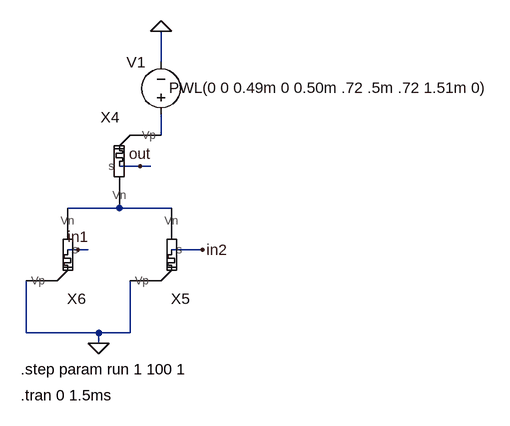
[diagram p0: schematic FELIX_variation.asc]
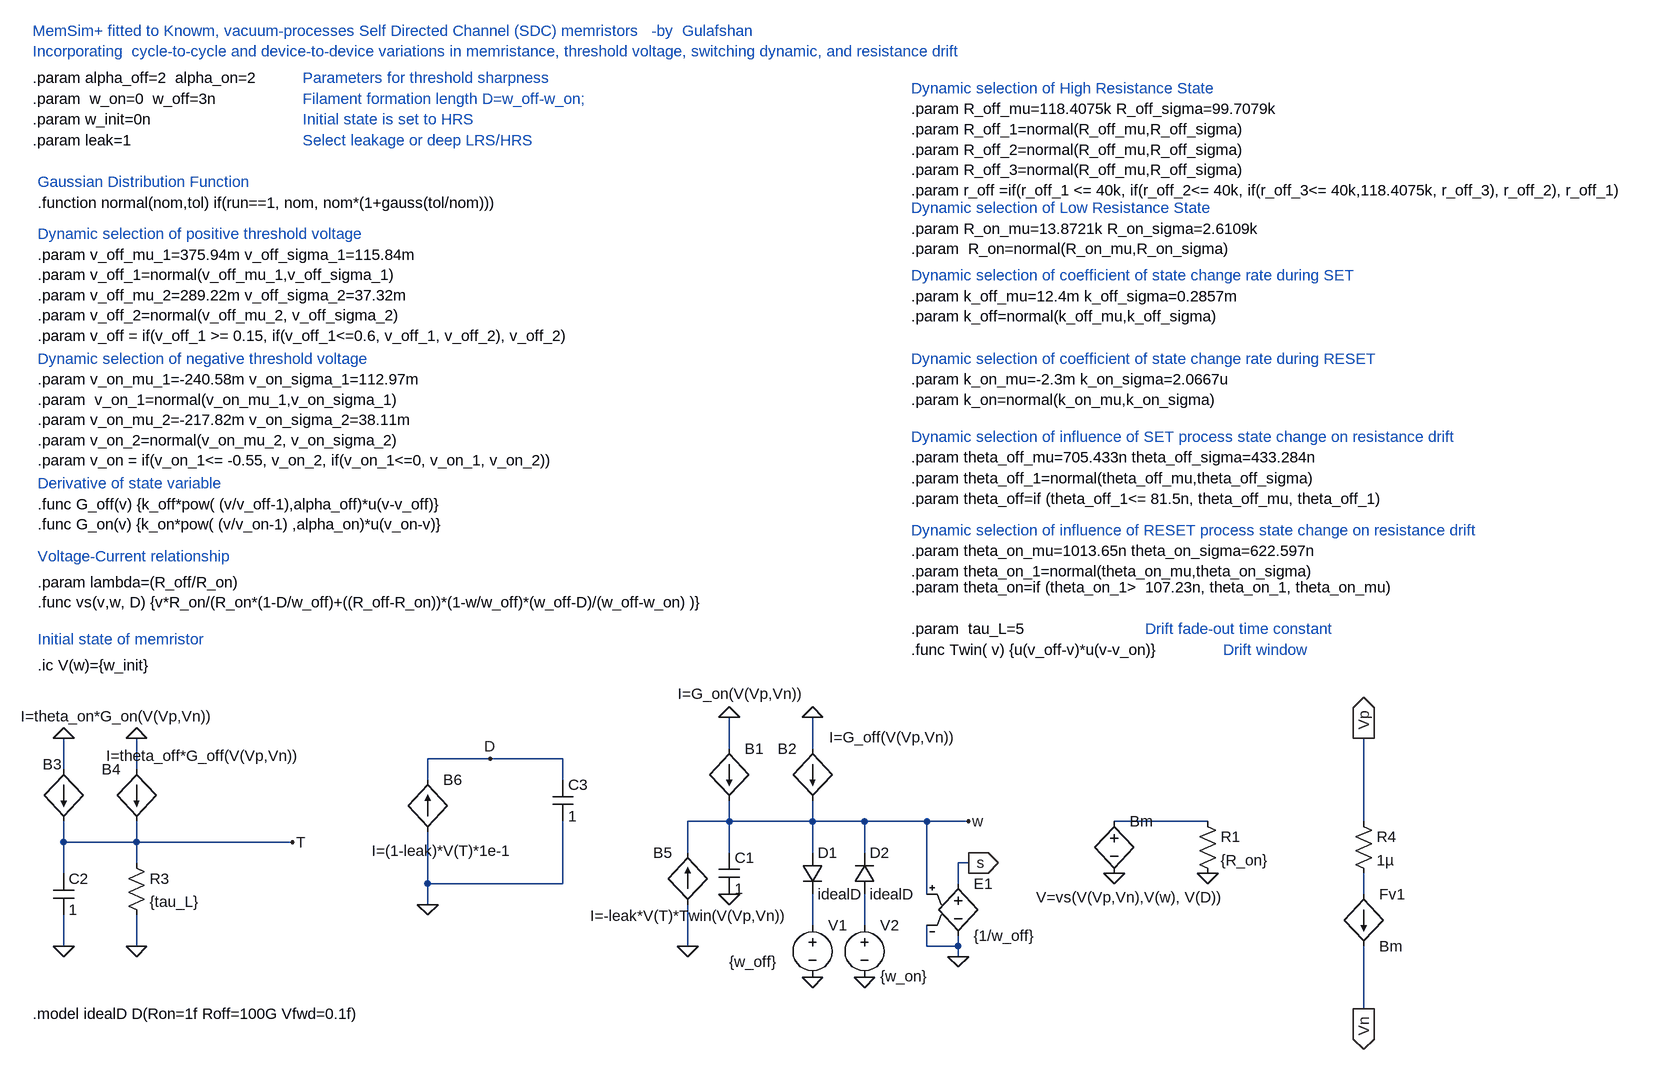
[diagram p1: sub-circuit memsim+sdc_variation.asc]
FELIX_variation.asc, the LTspice schematic file:
Version 4
SHEET 1 880 680
WIRE 256 -48 256 -96
WIRE 256 64 256 32
WIRE 224 112 192 112
WIRE 240 112 224 112
WIRE 192 176 112 176
WIRE 272 176 192 176
WIRE 128 240 112 240
WIRE 144 240 128 240
WIRE 320 240 272 240
WIRE 48 368 48 288
WIRE 160 368 48 368
WIRE 208 368 208 288
WIRE 208 368 160 368
WIRE 160 384 160 368
FLAG 160 384 0
FLAG 256 -96 0
FLAG 128 240 in1
FLAG 224 112 out
FLAG 320 240 in2
SYMBOL voltage 256 48 R180
WINDOW 0 24 96 Left 2
WINDOW 3 -506 57 Left 2
WINDOW 123 0 0 Left 0
WINDOW 39 0 0 Left 0
SYMATTR InstName V1
SYMATTR Value PWL(0 0 0.49m 0 0.50m .72 .5m .72 1.51m 0)
SYMBOL MemSim+SDC_variation 144 64 R0
SYMATTR InstName X4
SYMBOL MemSim+SDC_variation 320 288 R180
SYMATTR InstName X5
SYMBOL MemSim+SDC_variation 160 288 R180
SYMATTR InstName X6
TEXT 40 464 Left 2 !.tran 0 1.5ms
TEXT 40 424 Left 2 !.step param run 1 100 1

memsim+sdc_variation.asc, the sub-circuit schematic file:
Version 4
SHEET 1 2968 1664
WIRE 1120 800 1120 752
WIRE 1248 800 1248 752
WIRE 752 816 656 816
WIRE 864 816 752 816
WIRE 96 832 96 784
WIRE 208 832 208 784
WIRE 656 848 656 816
WIRE 864 848 864 816
WIRE 1120 912 1120 880
WIRE 1120 912 1056 912
WIRE 1248 912 1248 880
WIRE 1248 912 1120 912
WIRE 1328 912 1248 912
WIRE 1424 912 1328 912
WIRE 1488 912 1424 912
WIRE 1856 912 1712 912
WIRE 2096 912 2096 784
WIRE 96 944 96 912
WIRE 208 944 208 912
WIRE 208 944 96 944
WIRE 448 944 208 944
WIRE 1056 960 1056 912
WIRE 1120 960 1120 912
WIRE 1248 960 1248 912
WIRE 1328 960 1328 912
WIRE 208 976 208 944
WIRE 1488 976 1472 976
WIRE 96 992 96 944
WIRE 656 1008 656 928
WIRE 864 1008 864 912
WIRE 864 1008 656 1008
WIRE 1472 1008 1472 976
WIRE 1424 1024 1424 912
WIRE 2096 1024 2096 992
WIRE 656 1040 656 1008
WIRE 1248 1072 1248 1024
WIRE 1328 1072 1328 1024
WIRE 96 1104 96 1056
WIRE 208 1104 208 1056
WIRE 1056 1104 1056 1040
WIRE 1424 1104 1424 1072
WIRE 1472 1104 1472 1088
WIRE 1472 1104 1424 1104
WIRE 1472 1120 1472 1104
WIRE 2096 1200 2096 1104
FLAG 1120 752 0
FLAG 1248 752 0
FLAG 1120 1024 0
FLAG 1248 1152 0
FLAG 1328 1152 0
FLAG 1488 912 w
FLAG 1712 992 0
FLAG 1856 992 0
FLAG 1472 1120 0
FLAG 1488 976 s
IOPIN 1488 976 Out
FLAG 96 1104 0
FLAG 448 944 T
FLAG 96 784 0
FLAG 208 784 0
FLAG 208 1104 0
FLAG 1056 1104 0
FLAG 2096 784 Vp
IOPIN 2096 784 Out
FLAG 2096 1200 Vn
IOPIN 2096 1200 Out
FLAG 656 1040 0
FLAG 752 816 D
SYMBOL bi 1120 800 R0
WINDOW 3 -79 -84 Left 2
SYMATTR Value I=G_on(V(Vp,Vn))
SYMATTR InstName B1
SYMBOL bi 1248 800 M0
WINDOW 3 -220 -17 Left 2
SYMATTR Value I=G_off(V(Vp,Vn))
SYMATTR InstName B2
SYMBOL cap 1104 960 R0
SYMATTR InstName C1
SYMATTR Value 1
SYMBOL diode 1232 960 R0
SYMATTR InstName D1
SYMATTR Value idealD
SYMBOL diode 1312 1024 M180
WINDOW 0 24 64 Left 2
WINDOW 3 24 0 Left 2
SYMATTR InstName D2
SYMATTR Value idealD
SYMBOL voltage 1248 1056 R0
WINDOW 123 0 0 Left 2
WINDOW 39 0 0 Left 2
WINDOW 3 -128 72 Left 2
SYMATTR Value {w_off}
SYMATTR InstName V1
SYMBOL voltage 1328 1056 R0
WINDOW 3 24 94 Left 2
WINDOW 123 0 0 Left 2
WINDOW 39 0 0 Left 2
SYMATTR Value {w_on}
SYMATTR InstName V2
SYMBOL res 1840 896 R0
SYMATTR InstName R1
SYMATTR Value {R_on}
SYMBOL bv 1712 896 R0
WINDOW 3 -120 133 Left 2
SYMATTR Value V=vs(V(Vp,Vn),V(w), V(D))
SYMATTR InstName Bm
SYMBOL e 1472 992 R0
SYMATTR InstName E1
SYMATTR Value {1/w_off}
SYMBOL cap 80 992 R0
SYMATTR InstName C2
SYMATTR Value 1
SYMBOL bi 96 832 R0
WINDOW 3 -66 -82 Left 2
WINDOW 0 -32 -8 Left 2
SYMATTR Value I=theta_on*G_on(V(Vp,Vn))
SYMATTR InstName B3
SYMBOL bi 208 832 M0
WINDOW 3 -251 -21 Left 2
SYMATTR Value I=theta_off*G_off(V(Vp,Vn))
SYMATTR InstName B4
SYMBOL res 192 960 R0
SYMATTR InstName R3
SYMATTR Value {tau_L}
SYMBOL bi 1056 1040 R180
WINDOW 3 -154 -17 Left 2
WINDOW 0 24 80 Left 2
SYMATTR Value I=-leak*V(T)*Twin(V(Vp,Vn))
SYMATTR InstName B5
SYMBOL f 2096 1024 R0
SYMATTR InstName Fv1
SYMATTR Value Bm
SYMATTR Value2 -1
SYMBOL res 2080 896 R0
SYMATTR InstName R4
SYMATTR Value 1µ
SYMBOL bi 656 928 M180
WINDOW 3 -86 -29 Left 2
WINDOW 0 24 80 Left 2
SYMATTR Value I=(1-leak)*V(T)*1e-1
SYMATTR InstName B6
SYMBOL cap 848 848 R0
SYMATTR InstName C3
SYMATTR Value 1
TEXT 48 -232 Left 2 !.param alpha_off=2  alpha_on=2
TEXT 48 -200 Left 2 !.param  w_on=0  w_off=3n
TEXT 48 -304 Left 2 ;MemSim+ fitted to Knowm, vacuum-processes Self Directed Channel (SDC) memristors   -by  Gulafshan\nIncorporating  cycle-to-cycle and device-to-device variations in memristance, threshold voltage, switching dynamic, and resistance drift
TEXT 56 672 Left 2 !.ic V(w)={w_init}
TEXT 56 392 Left 2 ;Derivative of state variable
TEXT 56 504 Left 2 ;Voltage-Current relationship
TEXT 56 632 Left 2 ;Initial state of memristor
TEXT 48 1208 Left 2 !.model idealD D(Ron=1f Roff=100G Vfwd=0.1f)
TEXT 48 -168 Left 2 !.param w_init=0n
TEXT 56 -40 Left 2 !.function normal(nom,tol) if(run==1, nom, nom*(1+gauss(tol/nom)))
TEXT 1400 616 Left 2 !.param  tau_L=5
TEXT 1400 648 Left 2 !.func Twin( v) {u(v_off-v)*u(v-v_on)}
TEXT 1400 104 Left 2 !.param k_off_mu=12.4m k_off_sigma=0.2857m\n.param k_off=normal(k_off_mu,k_off_sigma)
TEXT 1400 232 Left 2 !.param k_on_mu=-2.3m k_on_sigma=2.0667u\n.param k_on=normal(k_on_mu,k_on_sigma)
TEXT 1400 352 Left 2 !.param theta_off_mu=705.433n theta_off_sigma=433.284n
TEXT 1400 384 Left 2 !.param theta_off_1=normal(theta_off_mu,theta_off_sigma)
TEXT 1400 416 Left 2 !.param theta_off=if (theta_off_1<= 81.5n, theta_off_mu, theta_off_1)
TEXT 1400 496 Left 2 !.param theta_on_mu=1013.65n theta_on_sigma=622.597n\n.param theta_on_1=normal(theta_on_mu,theta_on_sigma)
TEXT 1400 552 Left 2 !.param theta_on=if (theta_on_1>  107.23n, theta_on_1, theta_on_mu)
TEXT 56 8 Left 2 ;Dynamic selection of positive threshold voltage
TEXT 56 200 Left 2 ;Dynamic selection of negative threshold voltage
TEXT 1400 -216 Left 2 ;Dynamic selection of High Resistance State
TEXT 1400 -32 Left 2 ;Dynamic selection of Low Resistance State
TEXT 56 -72 Left 2 ;Gaussian Distribution Function
TEXT 464 -232 Left 2 ;Parameters for threshold sharpness
TEXT 464 -200 Left 2 ;Filament formation length D=w_off-w_on;
TEXT 464 -168 Left 2 ;Initial state is set to HRS
TEXT 1400 72 Left 2 ;Dynamic selection of coefficient of state change rate during SET
TEXT 1400 200 Left 2 ;Dynamic selection of coefficient of state change rate during RESET
TEXT 1400 320 Left 2 ;Dynamic selection of influence of SET process state change on resistance drift
TEXT 1400 464 Left 2 ;Dynamic selection of influence of RESET process state change on resistance drift
TEXT 1760 616 Left 2 ;Drift fade-out time constant
TEXT 1880 648 Left 2 ;Drift window
TEXT 48 -136 Left 2 !.param leak=1
TEXT 464 -136 Left 2 ;Select leakage or deep LRS/HRS
TEXT 56 40 Left 2 !.param v_off_mu_1=375.94m v_off_sigma_1=115.84m\n.param v_off_1=normal(v_off_mu_1,v_off_sigma_1)\n.param v_off_mu_2=289.22m v_off_sigma_2=37.32m\n.param v_off_2=normal(v_off_mu_2, v_off_sigma_2)\n.param v_off = if(v_off_1 >= 0.15, if(v_off_1<=0.6, v_off_1, v_off_2), v_off_2)
TEXT 56 232 Left 2 !.param v_on_mu_1=-240.58m v_on_sigma_1=112.97m\n.param  v_on_1=normal(v_on_mu_1,v_on_sigma_1)\n.param v_on_mu_2=-217.82m v_on_sigma_2=38.11m\n.param v_on_2=normal(v_on_mu_2, v_on_sigma_2)\n.param v_on = if(v_on_1<= -0.55, v_on_2, if(v_on_1<=0, v_on_1, v_on_2))
TEXT 56 424 Left 2 !.func G_off(v) {k_off*pow( (v/v_off-1),alpha_off)*u(v-v_off)}\n.func G_on(v) {k_on*pow( (v/v_on-1) ,alpha_on)*u(v_on-v)}
TEXT 56 544 Left 2 !.param lambda=(R_off/R_on)\n.func vs(v,w, D) {v*R_on/(R_on*(1-D/w_off)+((R_off-R_on))*(1-w/w_off)*(w_off-D)/(w_off-w_on) )}
TEXT 1400 -184 Left 2 !.param R_off_mu=118.4075k R_off_sigma=99.7079k\n.param R_off_1=normal(R_off_mu,R_off_sigma)\n.param R_off_2=normal(R_off_mu,R_off_sigma)\n.param R_off_3=normal(R_off_mu,R_off_sigma)\n.param r_off =if(r_off_1 <= 40k, if(r_off_2<= 40k, if(r_off_3<= 40k,118.4075k, r_off_3), r_off_2), r_off_1)
TEXT 1400 0 Left 2 !.param R_on_mu=13.8721k R_on_sigma=2.6109k\n.param  R_on=normal(R_on_mu,R_on_sigma)

The netlist it stands for:
* FELIX_variation.asc
V1 N001 0 PWL(0 0 0.49m 0 0.50m .72 .5m .72 1.51m 0)
XX4 out N001 N002 memsim+sdc_variation
XX5 in2 0 N002 memsim+sdc_variation
XX6 in1 0 N002 memsim+sdc_variation

* block symbol definitions
.subckt memsim+sdc_variation s Vp Vn
B1 0 w I=G_on(V(Vp,Vn))
B2 0 w I=G_off(V(Vp,Vn))
C1 w 0 1
D1 w N003 idealD
D2 N004 w idealD
V1 N003 0 {w_off}
V2 N004 0 {w_on}
R1 N001 0 {R_on}
Bm N001 0 V=vs(V(Vp,Vn),V(w), V(D))
E1 s 0 w 0 {1/w_off}
C2 T 0 1
B3 0 T I=theta_on*G_on(V(Vp,Vn))
B4 0 T I=theta_off*G_off(V(Vp,Vn))
R3 T 0 {tau_L}
B5 0 w I=-leak*V(T)*Twin(V(Vp,Vn))
Fv1 N002 Vn Bm -1
R4 Vp N002 1µ
B6 0 D I=(1-leak)*V(T)*1e-1
C3 D 0 1
.param alpha_off=2  alpha_on=2
.param  w_on=0  w_off=3n
* MemSim+ fitted to Knowm, vacuum-processes Self Directed Channel (SDC) memristors   -by  Gulafshan
* Incorporating  cycle-to-cycle and device-to-device variations in memristance, threshold voltage, switching dynamic, and resistance drift
.ic V(w)={w_init}
* Derivative of state variable
* Voltage-Current relationship
* Initial state of memristor
.model idealD D(Ron=1f Roff=100G Vfwd=0.1f)
.param w_init=0n
.function normal(nom,tol) if(run==1, nom, nom*(1+gauss(tol/nom)))
.param  tau_L=5
.func Twin( v) {u(v_off-v)*u(v-v_on)}
.param k_off_mu=12.4m k_off_sigma=0.2857m
.param k_off=normal(k_off_mu,k_off_sigma)
.param k_on_mu=-2.3m k_on_sigma=2.0667u
.param k_on=normal(k_on_mu,k_on_sigma)
.param theta_off_mu=705.433n theta_off_sigma=433.284n
.param theta_off_1=normal(theta_off_mu,theta_off_sigma)
.param theta_off=if (theta_off_1<= 81.5n, theta_off_mu, theta_off_1)
.param theta_on_mu=1013.65n theta_on_sigma=622.597n
.param theta_on_1=normal(theta_on_mu,theta_on_sigma)
.param theta_on=if (theta_on_1>  107.23n, theta_on_1, theta_on_mu)
* Dynamic selection of positive threshold voltage
* Dynamic selection of negative threshold voltage
* Dynamic selection of High Resistance State
* Dynamic selection of Low Resistance State
* Gaussian Distribution Function
* Parameters for threshold sharpness
* Filament formation length D=w_off-w_on;
* Initial state is set to HRS
* Dynamic selection of coefficient of state change rate during SET
* Dynamic selection of coefficient of state change rate during RESET
* Dynamic selection of influence of SET process state change on resistance drift
* Dynamic selection of influence of RESET process state change on resistance drift
* Drift fade-out time constant
* Drift window
.param leak=1
* Select leakage or deep LRS/HRS
.param v_off_mu_1=375.94m v_off_sigma_1=115.84m
.param v_off_1=normal(v_off_mu_1,v_off_sigma_1)
.param v_off_mu_2=289.22m v_off_sigma_2=37.32m
.param v_off_2=normal(v_off_mu_2, v_off_sigma_2)
.param v_off = if(v_off_1 >= 0.15, if(v_off_1<=0.6, v_off_1, v_off_2), v_off_2)
.param v_on_mu_1=-240.58m v_on_sigma_1=112.97m
.param  v_on_1=normal(v_on_mu_1,v_on_sigma_1)
.param v_on_mu_2=-217.82m v_on_sigma_2=38.11m
.param v_on_2=normal(v_on_mu_2, v_on_sigma_2)
.param v_on = if(v_on_1<= -0.55, v_on_2, if(v_on_1<=0, v_on_1, v_on_2))
.func G_off(v) {k_off*pow( (v/v_off-1),alpha_off)*u(v-v_off)}
.func G_on(v) {k_on*pow( (v/v_on-1) ,alpha_on)*u(v_on-v)}
.param lambda=(R_off/R_on)
.func vs(v,w, D) {v*R_on/(R_on*(1-D/w_off)+((R_off-R_on))*(1-w/w_off)*(w_off-D)/(w_off-w_on) )}
.param R_off_mu=118.4075k R_off_sigma=99.7079k
.param R_off_1=normal(R_off_mu,R_off_sigma)
.param R_off_2=normal(R_off_mu,R_off_sigma)
.param R_off_3=normal(R_off_mu,R_off_sigma)
.param r_off =if(r_off_1 <= 40k, if(r_off_2<= 40k, if(r_off_3<= 40k,118.4075k, r_off_3), r_off_2), r_off_1)
.param R_on_mu=13.8721k R_on_sigma=2.6109k
.param  R_on=normal(R_on_mu,R_on_sigma)
.ends memsim+sdc_variation

.model D D
.lib standard.dio
.tran 0 1.5ms
.step param run 1 100 1
.backanno
.end